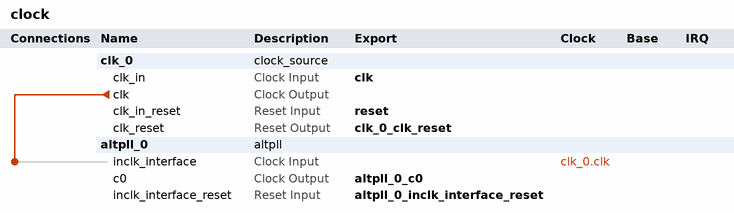
[diagram p0: system contents]
# Platform Designer (Qsys) system clock, Cyclone III EP3C16Q240C8
# Parameters at their usual value, and those the tool derives, are not listed.
package require -exact qsys 13.0
create_system clock
set_project_property DEVICE_FAMILY {Cyclone III}
set_project_property DEVICE EP3C16Q240C8

add_instance clk_0 clock_source 13.0
set_instance_parameter_value clk_0 clockFrequency 50000000

add_instance altpll_0 altpll 13.0
set_instance_parameter_value altpll_0 INCLK0_INPUT_FREQUENCY 20000
set_instance_parameter_value altpll_0 CLK0_MULTIPLY_BY 4
set_instance_parameter_value altpll_0 CLK0_DIVIDE_BY 1
set_instance_parameter_value altpll_0 PORT_clk1 PORT_UNUSED
set_instance_parameter_value altpll_0 PORT_clk2 PORT_UNUSED
set_instance_parameter_value altpll_0 PORT_clk3 PORT_UNUSED
set_instance_parameter_value altpll_0 PORT_ARESET PORT_UNUSED
set_instance_parameter_value altpll_0 PORT_LOCKED PORT_USED

# connections
add_connection clk_0.clk altpll_0.inclk_interface clock

# exported interfaces
add_interface clk clock sink
set_interface_property clk EXPORT_OF clk_0.clk_in
add_interface clk_0_clk_reset reset source
set_interface_property clk_0_clk_reset EXPORT_OF clk_0.clk_reset
add_interface reset reset sink
set_interface_property reset EXPORT_OF clk_0.clk_in_reset
add_interface altpll_0_inclk_interface_reset reset sink
set_interface_property altpll_0_inclk_interface_reset EXPORT_OF altpll_0.inclk_interface_reset
add_interface altpll_0_c0 clock source
set_interface_property altpll_0_c0 EXPORT_OF altpll_0.c0

set_interconnect_requirement {$system} qsys_mm.clockCrossingAdapter HANDSHAKE
set_interconnect_requirement {$system} qsys_mm.maxAdditionalLatency 1

save_system clock.qsys
